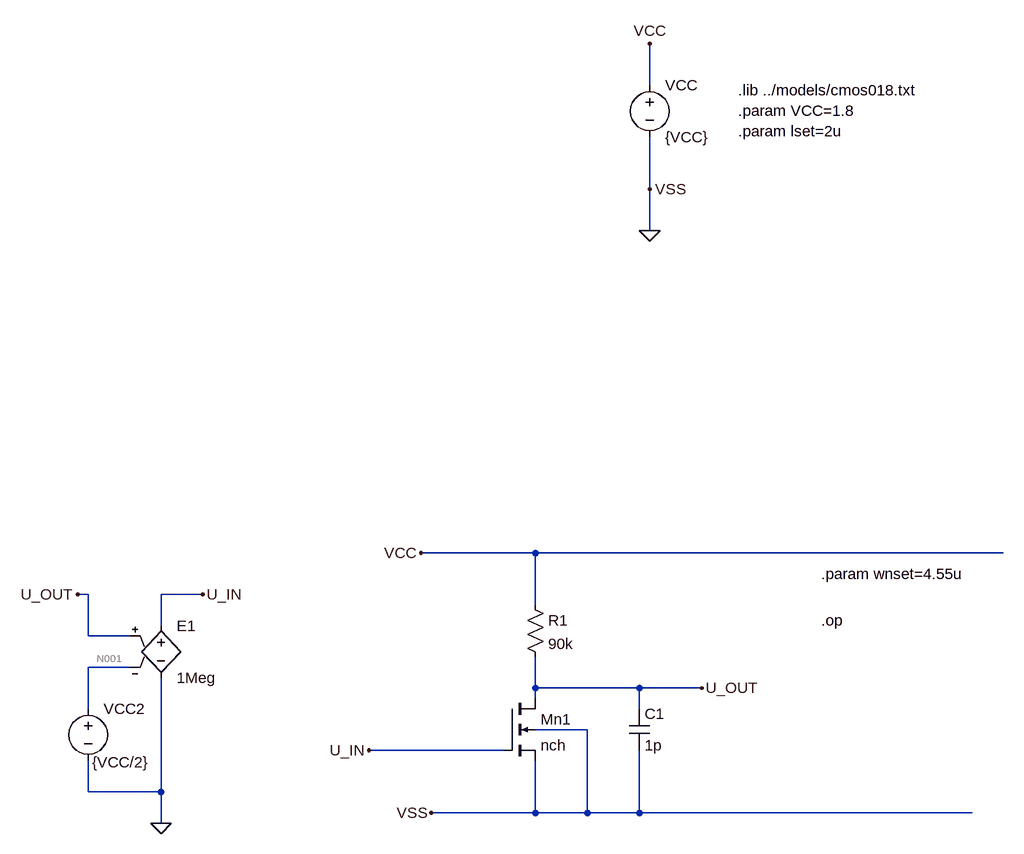
[diagram p0: schematic 4-1-1.asc]
4-1-1.asc, the LTspice schematic file:
Version 4
SHEET 1 2972 2004
WIRE 1072 -544 1072 -608
WIRE 1072 -384 1072 -464
WIRE 1072 -320 1072 -384
WIRE 896 176 720 176
WIRE 1616 176 896 176
WIRE 208 240 192 240
WIRE 384 240 320 240
WIRE 896 256 896 176
WIRE 320 288 320 240
WIRE 208 304 208 240
WIRE 272 304 208 304
WIRE 272 352 208 352
WIRE 896 384 896 336
WIRE 1056 384 896 384
WIRE 1152 384 1056 384
WIRE 896 400 896 384
WIRE 208 416 208 352
WIRE 1056 416 1056 384
WIRE 976 448 896 448
WIRE 848 480 640 480
WIRE 208 544 208 496
WIRE 320 544 320 368
WIRE 320 544 208 544
WIRE 896 576 896 496
WIRE 896 576 736 576
WIRE 976 576 976 448
WIRE 976 576 896 576
WIRE 1056 576 1056 480
WIRE 1056 576 976 576
WIRE 1568 576 1056 576
WIRE 320 592 320 544
FLAG 1072 -320 0
FLAG 1072 -608 VCC
FLAG 720 176 VCC
FLAG 736 576 VSS
FLAG 1072 -384 VSS
FLAG 1152 384 U_OUT
FLAG 640 480 U_IN
FLAG 384 240 U_IN
FLAG 192 240 U_OUT
FLAG 320 592 0
DATAFLAG 1056 176 ""
DATAFLAG 1056 384 ""
DATAFLAG 736 480 ""
DATAFLAG 976 256 "Id(Mn1)"
SYMBOL voltage 1072 -560 R0
WINDOW 123 0 0 Left 0
WINDOW 39 0 0 Left 0
SYMATTR InstName VCC
SYMATTR Value {VCC}
SYMBOL nmos4 848 400 R0
SYMATTR InstName Mn1
SYMATTR Value nch
SYMATTR Value2 l=lset w=wnset
SYMBOL res 880 240 R0
SYMATTR InstName R1
SYMATTR Value 90k
SYMBOL cap 1040 416 R0
SYMATTR InstName C1
SYMATTR Value 1p
SYMBOL e 320 272 R0
SYMATTR InstName E1
SYMATTR Value 1Meg
SYMBOL voltage 208 400 R0
WINDOW 123 0 0 Left 0
WINDOW 39 0 0 Left 0
WINDOW 3 6 98 Left 2
SYMATTR Value {VCC/2}
SYMATTR InstName VCC2
TEXT 1208 -536 Left 2 !.lib ../models/cmos018.txt\n.param VCC=1.8\n.param lset=2u
TEXT 1336 208 Left 2 !.param wnset=4.55u
TEXT 1336 280 Left 2 !.op

The netlist it stands for:
* 4-1-1.asc
VCC VCC 0 {VCC}
Mn1 U_OUT U_IN 0 0 nch l=lset w=wnset
R1 VCC U_OUT 90k
C1 U_OUT 0 1p
E1 U_IN 0 U_OUT N001 1Meg
VCC2 N001 0 {VCC/2}
.model NMOS NMOS
.model PMOS PMOS
.lib standard.mos
.lib ../models/cmos018.txt
.param VCC=1.8
.param lset=2u
.param wnset=4.55u
.op
.backanno
.end

* Results of the author's LTspice run, read from the files saved beside the schematic
* Operating Point:
*   V(vcc) = 1.8 V
*   V(u_out) = 900 mV
*   V(u_in) = 588.6 mV
*   V(n001) = 900 mV
*   Id(Mn1) = 10 µA
*   Ig(Mn1) = 0 A
*   Ib(Mn1) = -910 fA
*   Is(Mn1) = -10 µA
*   I(C1) = 0 A
*   I(R1) = 10 µA
*   I(E1) = 0 A
*   I(Vcc) = -10 µA
*   I(Vcc2) = 0 A
* From the log:
*   Semiconductor Device Operating Points:
*                           --- BSIM3 MOSFETS ---
*   Name:        mn1
*   Model:       nch
*   Id:        1.00e-05
*   Vgs:       5.89e-01
*   Vds:       9.00e-01
*   Vbs:       0.00e+00
*   Vth:       3.82e-01
*   Vdsat:     1.60e-01
*   Gm:        1.00e-04
*   Gds:       4.49e-07
*   Gmb        1.07e-04
*   Cbd:       0.00e+00
*   Cbs:       0.00e+00
*   Cgsov:     3.19e-15
*   Cgdov:     3.17e-15
*   Cgbov:     1.98e-18
*   dQgdVgb:   6.84e-14
*   dQgdVdb:  -3.05e-15
*   dQgdVsb:  -9.66e-14
*   dQddVgb:  -2.83e-14
*   dQddVdb:   3.10e-15
*   dQddVsb:   5.35e-14
*   dQbdVgb:  -1.18e-14
*   dQbdVdb:   1.22e-17
*   dQbdVsb:  -1.36e-14